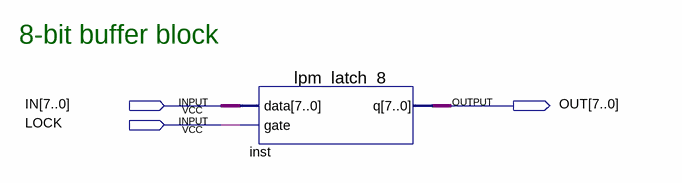
[diagram p0: schematic sheet]
// Quartus schematic block-buffer-8.bdf as structural Verilog: 1 symbols, 3 pins
module \block-buffer-8  (
  input  [7:0] IN,
  input  LOCK,
  output [7:0] OUT
);

  lpm_latch_8 inst (.data(IN), .gate(LOCK), .q(OUT));

  // Notes on the sheet:
  //   8-bit buffer block
endmodule
